# EAGLE board WIZ-SM20_005_final (EAGLE 6.5.0), part 1 of 2
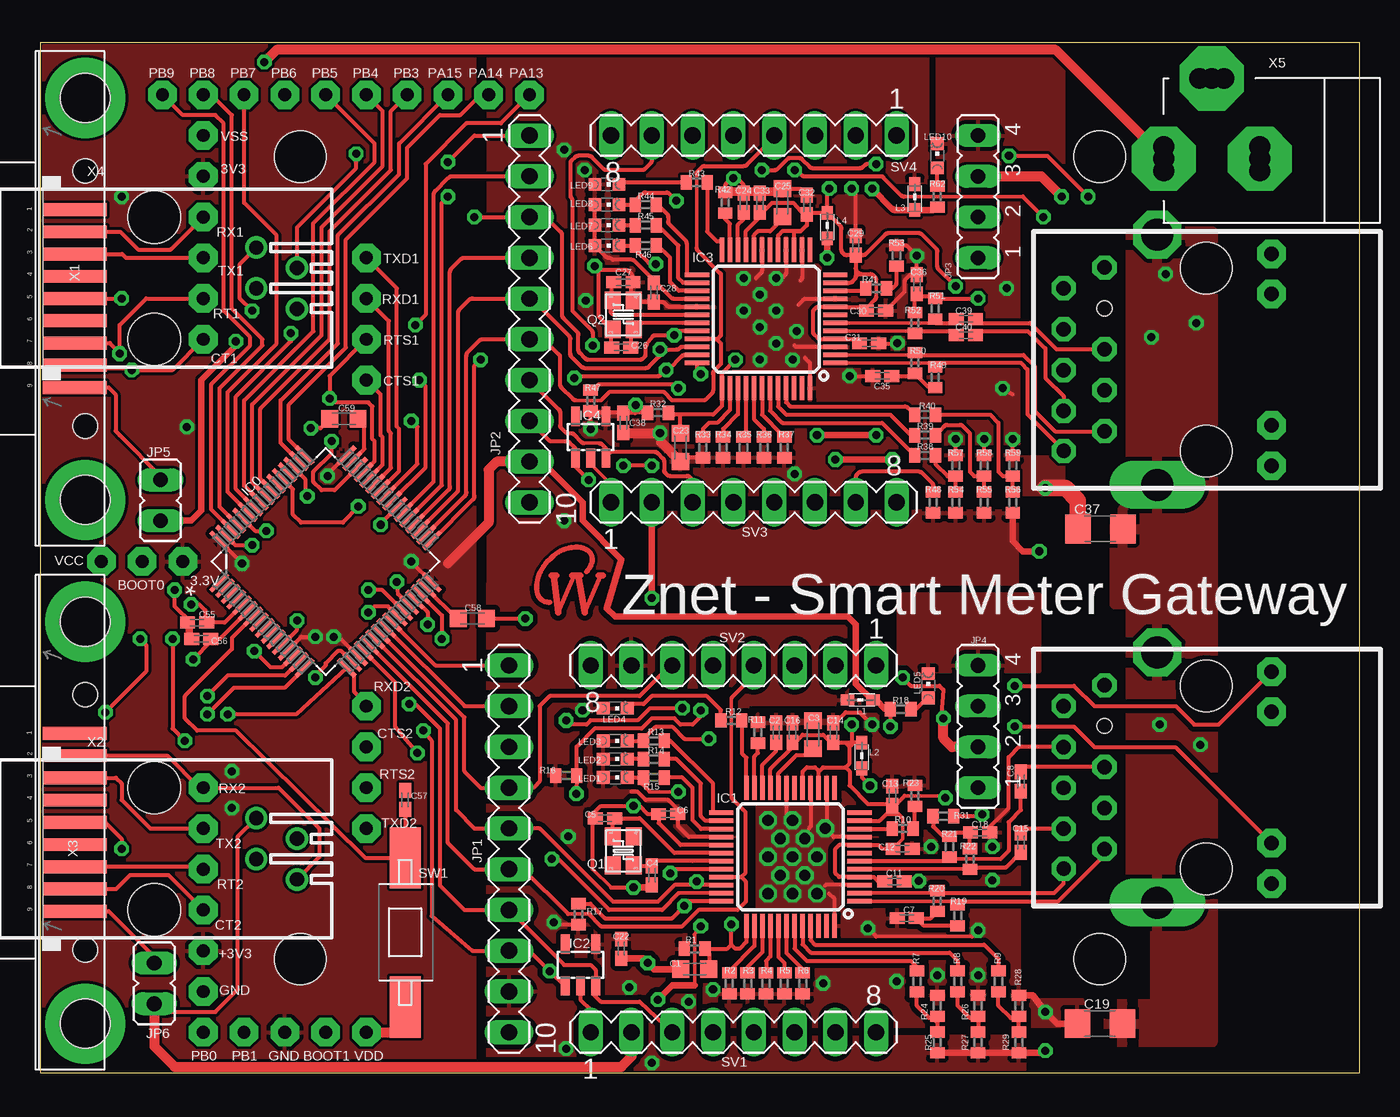
[diagram p2: board, top side]
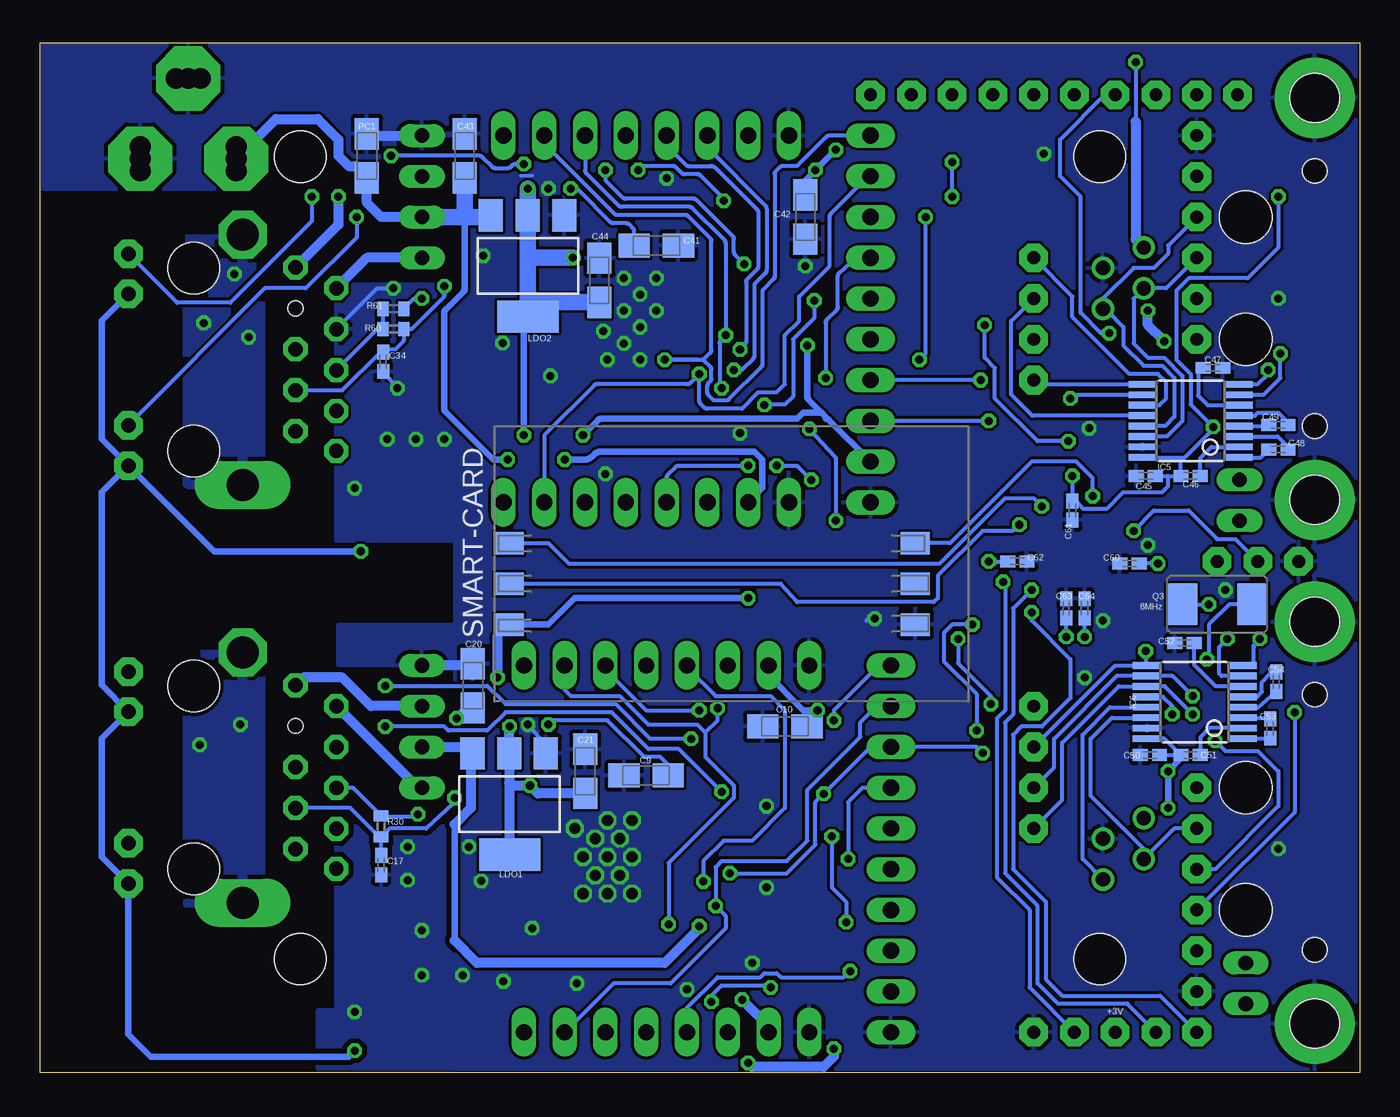
[diagram p3: board, bottom side, seen from below]

Size 82.2 x 64.2 mm. Coordinates in mm from the lower left corner, seen from the top.
Outline: 0,0 82.2,0 82.2,64.2 0,64.2 0,0
Copper layers (1*16): Top 0.035mm / dielectric 1.5mm / Bottom 0.035mm
Design rules "default *": minimum track width 8mil, minimum drill 18mil, track to track 7mil, track to pad 7mil, pad to pad 7mil, via to via 7mil, smd to smd 7mil, copper to edge 0mil, drill to drill 7mil, minimum pad ring 10mil, minimum via ring 8mil, stop-mask expansion 4mil, vias tented up to drill 0mil, thermal gap 10mil
Holes 3.2 mm at 16.2,57.1 66,7.1 66,57.1 16.2,7.1

## Footprints (pad centres in the part's own frame; a part is rotated, then mirrored left to right if it is on the bottom)
HALFHOLE = drill 0.8 pad 1.778 octagon: P$1 0,0
C0603K = smd 1.05 x 1.08: 1 -0.875,0; 2 0.875,0
C0402K = smd 0.925 x 0.74: 1 -0.6,0; 2 0.6,0
A/3216-18R = smd 1.95 x 1.5: + 1.375,0; - -1.375,0
C3216 = smd 1.6 x 1.8: 1 -1.4,0; 2 1.4,0
QFP50P1200X1200X160-64N = smd 1.473 x 0.279: 1 -5.613,3.759; 2 -5.613,3.251; 3 -5.613,2.743; 4 -5.613,2.261; 5 -5.613,1.753; 6 -5.613,1.245; 7 -5.613,0.762; 8 -5.613,0.254; 9 -5.613,-0.254; 10 -5.613,-0.762; 11 -5.613,-1.245; 12 -5.613,-1.753; 13 -5.613,-2.261; 14 -5.613,-2.743; 15 -5.613,-3.251; 16 -5.613,-3.759; 33 5.613,-3.759; 34 5.613,-3.251; 35 5.613,-2.743; 36 5.613,-2.261; 37 5.613,-1.753; 38 5.613,-1.245; 39 5.613,-0.762; 40 5.613,-0.254; 41 5.613,0.254; 42 5.613,0.762; 43 5.613,1.245; 44 5.613,1.753; 45 5.613,2.261; 46 5.613,2.743; 47 5.613,3.251; 48 5.613,3.759 | smd 0.279 x 1.473: 17 -3.759,-5.613; 18 -3.251,-5.613; 19 -2.743,-5.613; 20 -2.261,-5.613; 21 -1.753,-5.613; 22 -1.245,-5.613; 23 -0.762,-5.613; 24 -0.254,-5.613; 25 0.254,-5.613; 26 0.762,-5.613; 27 1.245,-5.613; 28 1.753,-5.613; 29 2.261,-5.613; 30 2.743,-5.613; 31 3.251,-5.613; 32 3.759,-5.613; 49 3.759,5.613; 50 3.251,5.613; 51 2.743,5.613; 52 2.261,5.613; 53 1.753,5.613; 54 1.245,5.613; 55 0.762,5.613; 56 0.254,5.613; 57 -0.254,5.613; 58 -0.762,5.613; 59 -1.245,5.613; 60 -1.753,5.613; 61 -2.261,5.613; 62 -2.743,5.613; 63 -3.251,5.613; 64 -3.759,5.613
LQFP48 = smd 1.5 x 0.28: 1 -4.3,2.75; 2 -4.3,2.25; 3 -4.3,1.75; 4 -4.3,1.25; 5 -4.3,0.75; 6 -4.3,0.25; 7 -4.3,-0.25; 8 -4.3,-0.75; 9 -4.3,-1.25; 10 -4.3,-1.75; 11 -4.3,-2.25; 12 -4.3,-2.75; 25 4.3,-2.75; 26 4.3,-2.25; 27 4.3,-1.75; 28 4.3,-1.25; 29 4.3,-0.75; 30 4.3,-0.25; 31 4.3,0.25; 32 4.3,0.75; 33 4.3,1.25; 34 4.3,1.75; 35 4.3,2.25; 36 4.3,2.75 | smd 0.28 x 1.5: 13 -2.75,-4.3; 14 -2.25,-4.3; 15 -1.75,-4.3; 16 -1.25,-4.3; 17 -0.75,-4.3; 18 -0.25,-4.3; 19 0.25,-4.3; 20 0.75,-4.3; 21 1.25,-4.3; 22 1.75,-4.3; 23 2.25,-4.3; 24 2.75,-4.3; 37 2.75,4.3; 38 2.25,4.3; 39 1.75,4.3; 40 1.25,4.3; 41 0.75,4.3; 42 0.25,4.3; 43 -0.25,4.3; 44 -0.75,4.3; 45 -1.25,4.3; 46 -1.75,4.3; 47 -2.25,4.3; 48 -2.75,4.3
SOT23-5L = smd 0.55 x 1.2: 1 -0.95,-1.3; 2 0,-1.3; 3 0.95,-1.3; 4 0.95,1.3; 5 -0.95,1.3
TSSOP16-L = smd 0.42 x 1.78: 1 -2.275,-2.97; 2 -1.625,-2.97; 3 -0.975,-2.97; 4 -0.325,-2.97; 5 0.325,-2.97; 6 0.975,-2.97; 7 1.625,-2.97; 8 2.275,-2.97; 9 2.275,2.97; 10 1.625,2.97; 11 0.975,2.97; 12 0.325,2.97; 13 -0.325,2.97; 14 -0.975,2.97; 15 -1.625,2.97; 16 -2.275,2.97
MA10-1 = drill 1.016 long: 1 -11.43,0; 2 -8.89,0; 3 -6.35,0; 4 -3.81,0; 5 -1.27,0; 6 1.27,0; 7 3.81,0; 8 6.35,0; 9 8.89,0; 10 11.43,0
JP4 = drill 0.914 long: 1 -3.81,0; 2 -1.27,0; 3 1.27,0; 4 3.81,0
JP1 = drill 0.914 long: 1 0,-1.27; 2 0,1.27
0603 = smd 0.85 x 0.7: 1 -0.9,0; 2 0.7,0
SOT223 = smd 1.499 x 2.007: 1 -2.261,-3.15; 2 0.025,-3.15; 3 2.311,-3.15 | smd 3.81 x 2.007: 4 0,3.15
CHIPLED_0603 = smd 0.8 x 0.8: A 0,-0.75; C 0,0.75
SMD02502-4 = smd 1.1 x 1: 1 -0.9,-0.65; 2 0.9,-0.65; 3 0.9,0.65; 4 -0.9,0.65
ABM7 = smd 1.9 x 2.6: 1 2.2,0; 2 -2.2,0
R0402 = smd 0.7 x 0.9: 1 -0.65,0; 2 0.65,0
RJPLB-203 = drill 0.9 pad 1.5 octagon: 1 -5.69,8.888; 2 -4.45,6.348; 3 -3.2,8.898; 4 -1.9,6.348; 5 -0.65,8.898; 6 0.65,6.348; 7 1.9,8.898; 9 4.45,8.898; 10 5.74,6.348 | drill 0.9 pad 1.778 octagon: 11 -6.6,-4.062; 12 -4.1,-4.062; 13 4.1,-4.062; 14 6.6,-4.062 | drill 2 pad 2.2 long: 15 -7.8,3.058 | drill 2 pad 3 octagon: 16 7.8,3.058 | hole 3.2: 5.7,0.008; -5.7,0.008 | hole 0.9: 3.2,6.35
7111S2015X02LF = smd 1.4 x 1.8: C1 -3.81,12.6; C2 -1.27,12.6; C3 1.27,12.6; C5 -3.81,-12.7; C6 -1.27,-12.7; C7 1.27,-12.7
MA08-1 = drill 1.016 long: 1 -8.89,0; 2 -6.35,0; 3 -3.81,0; 4 -1.27,0; 5 1.27,0; 6 3.81,0; 7 6.35,0; 8 8.89,0
1302 = smd 3.81 x 1.93: 1 -4.65,0; 2 4.65,0
NORCOMP_SMD = smd 0.8 x 4: 1 5.54,0; 2 4.155,0; 3 2.77,0; 4 1.385,0; 5 0,0; 6 -1.385,0; 7 -2.77,0; 8 -4.155,0; 9 -5.54,0 | drill 3.05 pad 5: 10 12.5,-0.65; 11 -12.55,-0.65 | hole 1.5: -7.95,-0.65; 7.95,-0.65 | hole 3.05: 12.5,-0.65; -12.55,-0.65
520249-2 = drill 0.889: 1 -1.905,6.35; 2 -0.635,8.89; 3 0.635,6.35; 4 1.905,8.89 | hole 3.251: -3.81,0; 3.81,0
POWERSUPPLY_DC-21MM = drill 1.3 pad 4 octagon: 1 -5.08,-3.353; 2 -0.076,-6.35; 3 -0.076,-0.356 | drill 1.3: 4 -5.08,-4.115; 5 -5.08,-2.591; 6 -0.838,-0.356; 7 0.686,-0.356; 8 -0.838,-6.35; 9 0.686,-6.35

## Placement (x,y rotation side)
3.3V  HALFHOLE  [HALFHOLE]  8.89,31.88 0 top
3V3  HALFHOLE  [HALFHOLE]  10.16,55.88 0 top
+3V  HALFHOLE  [HALFHOLE]  15.24,2.54 0 bottom
+3V3  HALFHOLE  [HALFHOLE]  10.16,7.62 0 top
BOOT0  HALFHOLE  [HALFHOLE]  6.35,31.88 0 top
BOOT1  HALFHOLE  [HALFHOLE]  17.78,2.54 0 top
C1  100n  [C0603K]  40.77,6.48 180 top
C2  10n  [C0402K]  45.85,21.21 90 top
C3  4.7µ  [C0603K]  48.13,21.08 90 top
C4  100n  [C0402K]  38.1,12.32 270 top
C5  100n  [C0402K]  35.18,15.88 180 top
C6  100n  [C0402K]  39.12,16.13 180 top
C7  100n  [C0402K]  53.98,9.65 180 top
C8  6n8  [C0402K]  61.09,18.16 270 top
C9  10uF/16V  [A/3216-18R]  44.45,18.54 0 bottom
C10  10uF/16V  [A/3216-18R]  35.81,21.59 0 bottom
C11  100n  [C0402K]  53.21,11.94 0 top
C12  100n  [C0402K]  53.72,13.97 0 top
C13  100n  [C0402K]  53.09,17.27 90 top
C14  100n  [C0402K]  49.4,21.21 90 top
C15  6n8  [C0402K]  61.09,14.35 270 top
C16  100n  [C0402K]  46.86,21.21 90 top
C17  100n  [C0402K]  60.96,12.95 270 bottom
C18  10n  [C0402K]  58.55,14.99 0 top
C19  1nF, 2kV  [C3216]  66.01,3.08 180 top
C20  10uF/16V  [A/3216-18R]  55.25,24.13 270 bottom
C21  10uF/16V  [A/3216-18R]  48.26,18.8 270 bottom
C22  100n  [C0402K]  36.2,7.75 270 top
C23  100n  [C0603K]  39.88,38.99 270 top
C24  10n  [C0402K]  43.82,54.23 90 top
C25  4.7µ  [C0603K]  46.23,54.23 90 top
C26  18p  [C0402K]  36.2,45.21 180 top
C27  18p  [C0402K]  36.32,49.28 0 top
C28  100n  [C0402K]  38.23,48.64 270 top
C29  100n  [C0402K]  50.8,51.56 90 top
C30  100n  [C0402K]  52.07,47.5 0 top
C31  100n  [C0402K]  51.64,45.47 0 top
C32  100n  [C0402K]  47.75,54.1 90 top
C33  100n  [C0402K]  44.83,54.23 90 top
C34  100n  [C0402K]  60.83,44.32 270 bottom
C35  100n  [C0402K]  52.45,43.43 180 top
C36  10n  [C0402K]  54.61,49.15 90 top
C37  1nF, 2kV  [C3216]  66.04,33.91 180 top
C38  100n  [C0402K]  36.32,40.51 270 top
C39  6n8  [C0402K]  57.66,46.99 180 top
C40  6n8  [C0402K]  57.66,45.97 180 top
C41  10uF/16V  [A/3216-18R]  43.82,51.56 180 bottom
C42  10uF/16V  [A/3216-18R]  34.54,53.34 90 bottom
C43  10uF/16V  [A/3216-18R]  55.75,57.15 270 bottom
C44  10uF/16V  [A/3216-18R]  47.37,49.4 270 bottom
C45  100n  [C0402K]  13.34,37.21 0 bottom
C46  100n  [C0402K]  10.54,37.21 0 bottom
C47  100n  [C0402K]  9.14,43.94 180 bottom
C48  100n  [C0402K]  5.08,38.86 180 bottom
C49  100n  [C0402K]  5.08,40.39 180 bottom
C50  100n  [C0402K]  13.08,19.81 0 bottom
C51  100n  [C0402K]  10.54,19.81 0 bottom
C52  100n  [C0402K]  10.92,26.8 0 bottom
C53  100n  [C0402K]  5.59,21.46 270 bottom
C54  100n  [C0402K]  5.21,24.38 270 bottom
C55  18p  [C0402K]  9.78,28.07 180 top
C56  18p  [C0402K]  10.03,27.05 180 top
C57  100n  [C0402K]  22.73,17.02 90 top
C58  2.2µ  [C0603K]  26.92,28.32 180 top
C59  2.2µ  [C0603K]  18.92,40.77 0 top
C60  100n  [C0402K]  14.35,31.75 0 bottom
C61  100n  [C0402K]  17.91,35.05 90 bottom
C62  100n  [C0402K]  21.34,31.88 180 bottom
C63  100n  [C0402K]  18.29,28.96 270 bottom
C64  100n  [C0402K]  17.15,28.96 270 bottom
CT1  HALFHOLE  [HALFHOLE]  10.16,45.72 0 top
CT2  HALFHOLE  [HALFHOLE]  10.16,10.16 0 top
CTS1  HALFHOLE  [HALFHOLE]  20.32,43.18 0 top
CTS2  HALFHOLE  [HALFHOLE]  20.32,20.32 180 top
GND  HALFHOLE  [HALFHOLE]  10.16,5.08 0 top
IC0  STM32F205RCT6  [QFP50P1200X1200X160-64N]  17.78,31.88 45 top
IC1  W5500  [LQFP48]  46.74,13.46 180 top
IC2  24AA02E48  [SOT23-5L]  33.66,6.73 0 top
IC3  W5500  [LQFP48]  45.21,46.99 180 top
IC4  24AA02E48  [SOT23-5L]  34.29,39.62 0 top
IC5  MAX3232  [TSSOP16-L]  10.54,40.64 90 bottom
IC6  MAX3232  [TSSOP16-L]  10.29,23.11 90 bottom
JP1  @ Tessel  [MA10-1]  29.21,13.97 270 top
JP2  @ Tessel  [MA10-1]  30.48,46.99 270 top
JP3  [JP4]  58.42,54.61 90 top
JP4  [JP4]  58.42,21.59 90 top
JP5  [JP1]  7.49,35.69 0 top
JP6  [JP1]  7.11,5.59 0 top
L1  [0603]  51.18,23.24 0 top
L2  [0603]  51.18,19.68 270 top
L3  [0603]  54.48,54.48 270 top
L4  [0603]  49.02,52.7 270 top
LDO1  AME8815BEGT  [SOT223]  52.96,16.76 180 bottom
LDO2  AME8815BEGT  [SOT223]  51.82,50.29 180 bottom
LED1  [CHIPLED_0603]  35.81,18.41 270 top
LED2  [CHIPLED_0603]  35.81,19.56 270 top
LED3  [CHIPLED_0603]  35.81,20.7 270 top
LED4  [CHIPLED_0603]  35.81,22.73 270 top
LED5  [CHIPLED_0603]  55.31,24.13 0 top
LED6  [CHIPLED_0603]  35.31,51.56 270 top
LED7  [CHIPLED_0603]  35.31,52.83 270 top
LED8  [CHIPLED_0603]  35.31,54.1 270 top
LED9  [CHIPLED_0603]  35.31,55.37 270 top
LED10  [CHIPLED_0603]  55.88,57.15 0 top
PA13  HALFHOLE  [HALFHOLE]  30.48,60.96 0 top
PA14  HALFHOLE  [HALFHOLE]  27.94,60.96 0 top
PA15  HALFHOLE  [HALFHOLE]  25.4,60.96 0 top
PB0  HALFHOLE  [HALFHOLE]  10.16,2.54 0 top
PB1  HALFHOLE  [HALFHOLE]  12.7,2.54 0 top
PB3  HALFHOLE  [HALFHOLE]  22.86,60.96 0 top
PB4  HALFHOLE  [HALFHOLE]  20.32,60.96 0 top
PB5  HALFHOLE  [HALFHOLE]  17.78,60.96 0 top
PB6  HALFHOLE  [HALFHOLE]  15.24,60.96 0 top
PB7  HALFHOLE  [HALFHOLE]  12.7,60.96 0 top
PB8  HALFHOLE  [HALFHOLE]  10.16,60.96 0 top
PB9  HALFHOLE  [HALFHOLE]  7.62,60.96 0 top
PC1  47u  [A/3216-18R]  61.85,57.15 270 bottom
Q1  25MHz  [SMD02502-4]  36.32,13.84 270 top
Q2  25MHz  [SMD02502-4]  36.32,47.24 270 top
Q3  8MHz  [ABM7]  8.89,29.21 180 bottom
R1  10k  [R0402]  40.77,7.75 180 top
R2  10k  [R0402]  42.93,5.59 270 top
R3  10k  [R0402]  44.07,5.59 270 top
R4  10k  [R0402]  45.21,5.59 270 top
R5  10k  [R0402]  46.36,5.59 270 top
R6  10k  [R0402]  47.5,5.59 270 top
R7  10k  [R0402]  54.61,5.71 270 top
R8  10k  [R0402]  57.15,5.71 270 top
R9  10k  [R0402]  59.69,5.71 270 top
R10  6k8 1%  [R0402]  53.72,15.24 180 top
R11  10k  [R0402]  44.7,21.21 270 top
R12  470  [R0402]  43.05,21.97 180 top
R13  470  [R0402]  38.23,20.7 180 top
R14  470  [R0402]  38.23,19.56 180 top
R15  470  [R0402]  38.23,18.41 180 top
R16  10k  [R0402]  32.77,18.54 180 top
R17  10k  [R0402]  33.53,9.91 270 top
R18  10k  [R0402]  53.59,22.67 180 top
R19  49.9R  [R0402]  57.15,9.83 270 top
R20  49.9R  [R0402]  55.88,10.72 270 top
R21  49.9R  [R0402]  56.64,14.1 270 top
R22  49.9R  [R0402]  57.91,13.34 270 top
R23  5k6k 1%  [R0402]  54.48,17.27 270 top
R24  0  [R0402]  55.88,4.19 270 top
R25  0  [R0402]  55.88,1.91 270 top
R26  0  [R0402]  58.42,4.19 270 top
R27  0  [R0402]  58.42,1.91 270 top
R28  0  [R0402]  60.96,4.19 270 top
R29  0  [R0402]  60.96,1.91 270 top
R30  0  [R0402]  60.96,15.37 270 bottom
R31  0  [R0402]  56.26,16 0 top
R32  10k  [R0402]  38.48,41.15 180 top
R33  10k  [R0402]  41.28,38.99 270 top
R34  10k  [R0402]  42.55,38.99 270 top
R35  10k  [R0402]  43.82,38.99 270 top
R36  10k  [R0402]  45.09,38.99 270 top
R37  10k  [R0402]  46.36,38.99 270 top
R38  10k  [R0402]  55.12,38.48 0 top
R39  10k  [R0402]  55.12,39.75 0 top
R40  10k  [R0402]  55.12,41.02 0 top
R41  6k8 1%  [R0402]  52.07,48.9 180 top
R42  10k  [R0402]  42.67,54.23 270 top
R43  470  [R0402]  40.89,55.5 180 top
R44  470  [R0402]  37.72,54.1 180 top
R45  470  [R0402]  37.72,52.83 180 top
R46  470  [R0402]  37.72,51.56 180 top
R47  10k  [R0402]  34.29,41.91 270 top
R48  10k  [R0402]  55.63,35.56 270 top
R49  49.9R  [R0402]  55.75,43.36 270 top
R50  49.9R  [R0402]  54.48,44.25 270 top
R51  49.9R  [R0402]  55.75,47.62 270 top
R52  49.9R  [R0402]  54.48,46.74 270 top
R53  5k6k 1%  [R0402]  53.34,50.93 270 top
R54  0  [R0402]  57.02,35.56 270 top
R55  0  [R0402]  58.8,35.56 270 top
R56  0  [R0402]  60.58,35.56 270 top
R57  0  [R0402]  57.02,37.85 270 top
R58  0  [R0402]  58.8,37.85 270 top
R59  0  [R0402]  60.58,37.85 270 top
R60  0  [R0402]  60.2,46.35 0 bottom
R61  0  [R0402]  60.2,47.62 180 bottom
R62  10k  [R0402]  55.88,54.61 270 top
RJ45_1  RJPLB-203TC1  [RJPLB-203]  72.64,18.41 90 top
RJ45_2  RJPLB-203TC1  [RJPLB-203]  72.64,44.45 90 top
RT1  HALFHOLE  [HALFHOLE]  10.16,48.26 0 top
RT2  HALFHOLE  [HALFHOLE]  10.16,12.7 0 top
RTS1  HALFHOLE  [HALFHOLE]  20.32,45.72 0 top
RTS2  HALFHOLE  [HALFHOLE]  20.32,17.78 180 top
RX1  HALFHOLE  [HALFHOLE]  10.16,53.34 180 top
RX2  HALFHOLE  [HALFHOLE]  10.16,17.78 0 top
RXD1  HALFHOLE  [HALFHOLE]  20.32,48.26 0 top
RXD2  HALFHOLE  [HALFHOLE]  20.32,22.86 180 top
SMART-CARD  [7111S2015X02LF]  40.39,31.75 90 bottom
SV1  [MA08-1]  43.18,2.54 0 top
SV2  [MA08-1]  43.18,25.4 180 top
SV3  [MA08-1]  44.45,35.56 0 top
SV4  [MA08-1]  44.45,58.42 180 top
SW1  Reset  [1302]  22.73,8.76 90 top
TX1  HALFHOLE  [HALFHOLE]  10.16,50.8 180 top
TX2  HALFHOLE  [HALFHOLE]  10.16,15.24 0 top
TXD1  HALFHOLE  [HALFHOLE]  20.32,50.8 0 top
TXD2  HALFHOLE  [HALFHOLE]  20.32,15.24 180 top
VCC  HALFHOLE  [HALFHOLE]  3.81,31.88 0 top
VDD  HALFHOLE  [HALFHOLE]  20.32,2.54 0 top
VSS  HALFHOLE  [HALFHOLE]  10.16,58.42 0 top
X1  [NORCOMP_SMD]  2.16,48.26 90 top
X2  RJ10  [520249-2]  7.11,13.97 270 top
X3  [NORCOMP_SMD]  2.16,15.62 90 top
X4  RJ10  [520249-2]  7.11,49.53 270 top
X5  5V  [POWERSUPPLY_DC-21MM]  76.33,56.9 270 top